# Altium schematic sheet Connectors.SchDoc: =ProjectTitle
size 420 x 297 mm; Address1: Address1; Address2: Address2; Address3: Address3; Address4: Address4; SheetNumber: 2; SheetTotal: 2; Scale: 1:1; DocumentType: Схема электрическая принципиальная
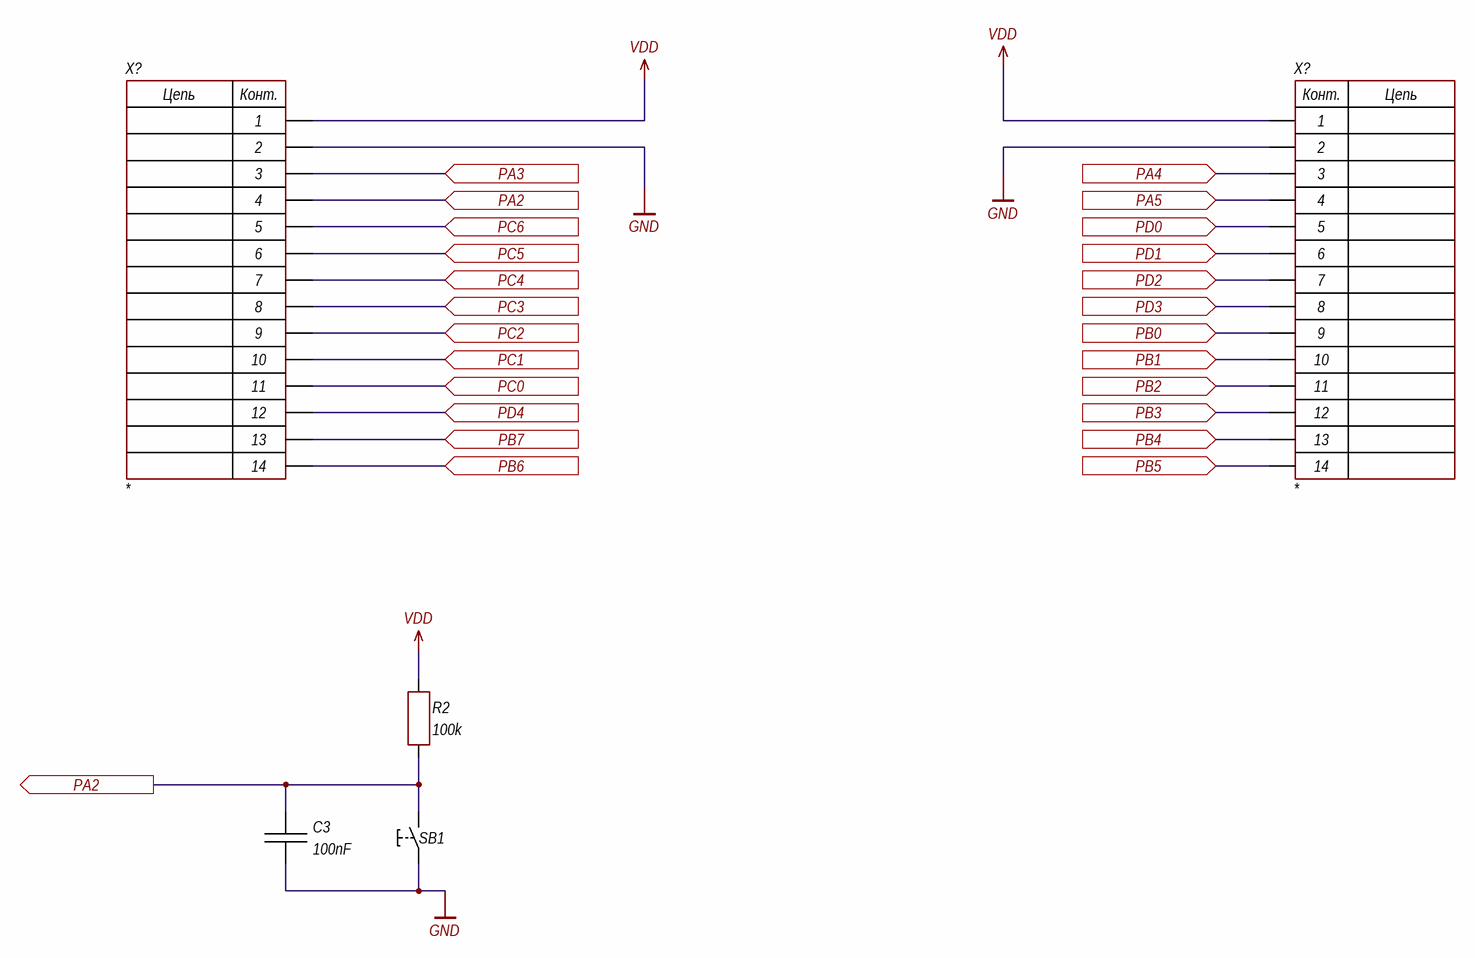
[diagram p0: Connectors.SchDoc]

## Parts
(Parts that share a designator on the sheet are numbered #1, #2 ... from top to bottom, then left to right.)
C3  100nF  [CH0402C]
R2  100k  [CH0402R]
SB1  "Кнопка"  [BUT: YTS-A017]  (value not drawn)
X?#1  *  [CON: PLS-14]
X?#2  *  [CON: PLS-14]

## Ports
PA2 (in), PA2 (out), PA3 (in), PA4 (in), PA5 (in), PB0 (in), PB1 (in), PB2 (in), PB3 (in), PB4 (in), PB5 (in), PB6 (in), PB7 (in), PC0 (in), PC1 (in), PC2 (in), PC3 (in), PC4 (in), PC5 (in), PC6 (in), PD0 (in), PD1 (in), PD2 (in), PD3 (in), PD4 (in)

## Nets
GND: C3.1 SB1.1 X?#1.2 X?#2.2
VDD: R2.2 X?#1.1 X?#2.1
PA2: C3.2 R2.1 SB1.2 X?#1.4 ; port PA2
PA3: X?#1.3 ; port PA3
PA4: X?#2.3 ; port PA4
PA5: X?#2.4 ; port PA5
PB0: X?#2.9 ; port PB0
PB1: X?#2.10 ; port PB1
PB2: X?#2.11 ; port PB2
PB3: X?#2.12 ; port PB3
PB4: X?#2.13 ; port PB4
PB5: X?#2.14 ; port PB5
PB6: X?#1.14 ; port PB6
PB7: X?#1.13 ; port PB7
PC0: X?#1.11 ; port PC0
PC1: X?#1.10 ; port PC1
PC2: X?#1.9 ; port PC2
PC3: X?#1.8 ; port PC3
PC4: X?#1.7 ; port PC4
PC5: X?#1.6 ; port PC5
PC6: X?#1.5 ; port PC6
PD0: X?#2.5 ; port PD0
PD1: X?#2.6 ; port PD1
PD2: X?#2.7 ; port PD2
PD3: X?#2.8 ; port PD3
PD4: X?#1.12 ; port PD4

## Notes on the sheet
- Изм.
- Лист
- № докум.
- Подп.
- Дата
- 2.106-A3
- Копировал
- Формат А3
- (in symbol 14-Connector) Конт.; Цепь

## Library data of the parts
C3 = Capacitor: Manufacturer: *; Model: *; HelpURL: *; ComponentKind: *; Value: 100nF
R2 = Resistor: Manufacturer: *; Model: *; HelpURL: *; ComponentKind: *; Value: 100k
SB1 = 1-Button: Button, no latching; Manufacturer: *; Model: *; HelpURL: *; ComponentKind: *
X?#1 X?#2 = 14-Connector: Model: *; Manufacturer: *; HelpURL: *; ComponentKind: *